# Altium schematic sheet 03. ZIGBEE.SchDoc
size A3; DocumentNumber: 3; SheetNumber: 3; SheetTotal: 12
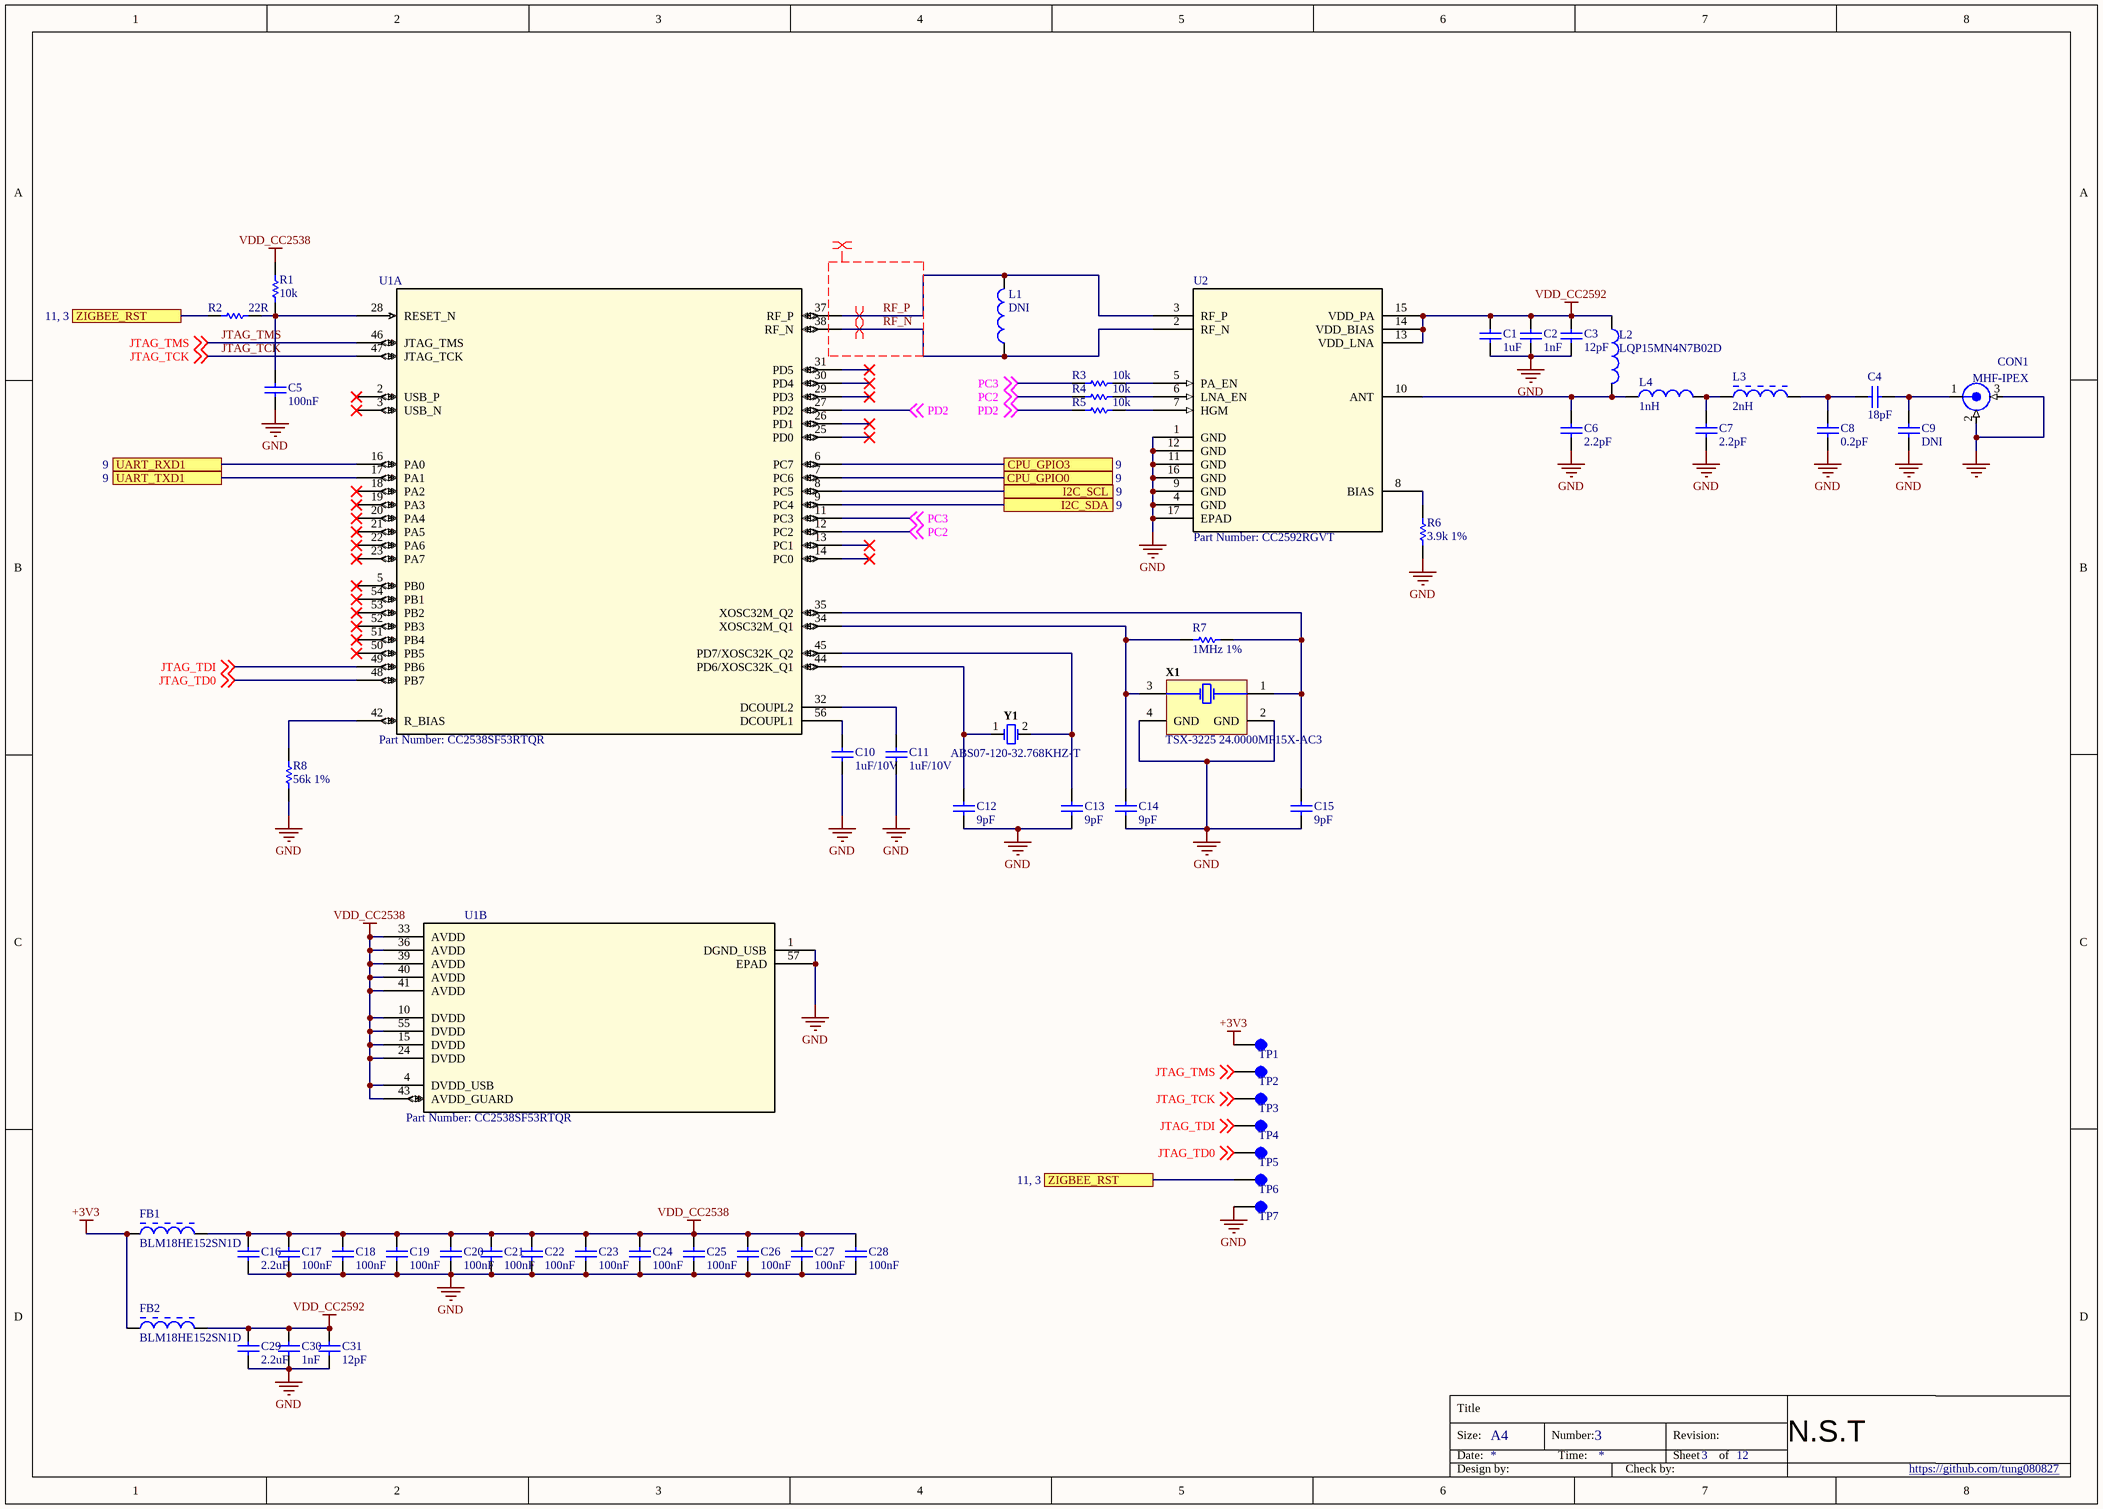
[diagram p0: 03. ZIGBEE.SchDoc]

## Parts
C1  1uF  [CAPC1608X90X20NL10]
C2  1nF  [CAPC1005X55X25NL05T10]
C3  12pF  [CAPC1005X55X25NL05T10]
C4  18pF  [CAPC1005X55X25NL05T10]
C5  100nF  [CAPC1005X56X25NL10T15]
C6  2.2pF  [CAPC1005X55X25NL05T10]
C7  2.2pF  [CAPC1005X55X25NL05T10]
C8  0.2pF  [CAPC1005X55X25NL05T10]
C9  DNI  [CAPC1005X55X25NL05T10]
C10  1uF/10V  [CAPC1005X55X25NL05T10]
C11  1uF/10V  [CAPC1005X55X25NL05T10]
C12  9pF  [CAPC1005X55X25NL05T10]
C13  9pF  [CAPC1005X55X25NL05T10]
C14  9pF  [CAPC1005X55X25NL05T10]
C15  9pF  [CAPC1005X55X25NL05T10]
C16  2.2uF  [CAPC1608X90X35NL10T15]
C17  100nF  [CAPC1005X56X25NL10T15]
C18  100nF  [CAPC1005X56X25NL10T15]
C19  100nF  [CAPC1005X56X25NL10T15]
C20  100nF  [CAPC1005X56X25NL10T15]
C21  100nF  [CAPC1005X56X25NL10T15]
C22  100nF  [CAPC1005X56X25NL10T15]
C23  100nF  [CAPC1005X56X25NL10T15]
C24  100nF  [CAPC1005X56X25NL10T15]
C25  100nF  [CAPC1005X56X25NL10T15]
C26  100nF  [CAPC1005X56X25NL10T15]
C27  100nF  [CAPC1005X56X25NL10T15]
C28  100nF  [CAPC1005X56X25NL10T15]
C29  2.2uF  [CAPC1608X90X35NL10T15]
C30  1nF  [CAPC1005X55X25NL05T10]
C31  12pF  [CAPC1005X55X25NL05T10]
CON1  MHF-IPEX  [I-PEX CON]
FB1  BLM18HE152SN1D  [MURA-BLM18-RF-H4-CHIP-2_V]
FB2  BLM18HE152SN1D  [MURA-BLM18-RF-H4-CHIP-2_V]
L1  DNI  [INDC1005X45X25NL10T10]
L2  LQP15MN4N7B02D  [INDC1005X45X25LL10T10]
L3  2nH  [MURA-IND0402_V]
L4  1nH  [INDC1005X45X25NL10T10]
R1  10k  [RESC1005X40X25NL05T05]
R2  22R  [RESC1005X40X25LL05T05]
R3  10k  [RESC1005X40X25NL05T05]
R4  10k  [RESC1005X40X25NL05T05]
R5  10k  [RESC1005X40X25NL05T05]
R6  3.9k 1%  [RESC1005X40X25NL05T05]
R7  1MHz 1%  [RESC1005X40X25NL05T05]
R8  56k 1%  [RESC1005X40X25NL05T05]
TP1  Test Point  [TP]  (value not drawn)
TP2  Test Point  [TP]  (value not drawn)
TP3  Test Point  [TP]  (value not drawn)
TP4  Test Point  [TP]  (value not drawn)
TP5  Test Point  [TP]  (value not drawn)
TP6  Test Point  [TP]  (value not drawn)
TP7  Test Point  [TP]  (value not drawn)
U1  Part Number: CC2538SF53RTQR  [QFN56_6P7X6P7]  (parts A,B of 2)
U2  Part Number: CC2592RGVT  [QFN16_2P16X2P16]
X1  TSX-3225 24.0000MF15X-AC3  [FP-NX3225SA-MFG]
Y1  ABS07-120-32.768KHZ-T  [ABRA-ABS07_A_V]

## Ports
CPU_GPIO0 (see 9), CPU_GPIO3 (see 9), I2C_SCL (see 9), I2C_SDA (see 9), UART_RXD1 (see 9), UART_TXD1 (see 9), ZIGBEE_RST (see 11, 3)

## Nets
+3V3: FB1.1 FB2.1 TP1.1
GND: C1.1 C2.1 C3.1 C5.1 C6.1 C7.1 C8.1 C9.1 C10.1 C11.1 C12.1 C13.1 C14.1 C15.1 C16.1 C17.1 C18.1 C19.1 C20.1 C21.1 C22.1 C23.1 C24.1 C25.1 C26.1 C27.1 C28.1 C29.1 C30.1 C31.1 CON1.2 CON1.3(GNDA) R6.1 R8.1 TP7.1 U1.1(DGND_USB) U1.57(EPAD) U2.1(GND) U2.4(GND) U2.9(GND) U2.11(GND) U2.12(GND) U2.16(GND) U2.17(EPAD) X1.2(GND) X1.4(GND)
VDD_CC2538: C16.2 C17.2 C18.2 C19.2 C20.2 C21.2 C22.2 C23.2 C24.2 C25.2 C26.2 C27.2 C28.2 FB1.2 R1.2 U1.4(DVDD_USB) U1.10(DVDD) U1.15(DVDD) U1.24(DVDD) U1.33(AVDD) U1.36(AVDD) U1.39(AVDD) U1.40(AVDD) U1.41(AVDD) U1.43(AVDD_GUARD) U1.55(DVDD)
VDD_CC2592: C1.2 C2.2 C3.2 C29.2 C30.2 C31.2 FB2.2 L2.1 U2.13(VDD_LNA) U2.14(VDD_BIAS) U2.15(VDD_PA)
CPU_GPIO0: U1.7(PC6) ; port CPU_GPIO0
CPU_GPIO3: U1.6(PC7) ; port CPU_GPIO3
I2C_SCL: U1.8(PC5) ; port I2C_SCL
I2C_SDA: U1.9(PC4) ; port I2C_SDA
JTAG_TCK: TP3.1 U1.47(JTAG_TCK) ; off-sheet JTAG_TCK
JTAG_TD0: TP5.1 U1.48(PB7) ; off-sheet JTAG_TD0
JTAG_TDI: TP4.1 U1.49(PB6) ; off-sheet JTAG_TDI
JTAG_TMS: TP2.1 U1.46(JTAG_TMS) ; off-sheet JTAG_TMS
PC2: R4.1 U1.12(PC2) ; off-sheet PC2
PC3: R3.1 U1.11(PC3) ; off-sheet PC3
PD2: R5.1 U1.27(PD2) ; off-sheet PD2
RF_N: L1.1 U1.38(RF_N) U2.2(RF_N)
RF_P: L1.2 U1.37(RF_P) U2.3(RF_P)
UART_RXD1: U1.16(PA0) ; port UART_RXD1
UART_TXD1: U1.17(PA1) ; port UART_TXD1
ZIGBEE_RST: R2.1 TP6.1 ; port ZIGBEE_RST
NetC4_1: C4.1 C8.2 L3.2
NetC4_2: C4.2 C9.2 CON1.1
NetC5_2: C5.2 R1.1 R2.2 U1.28(RESET_N)
NetC6_2: C6.2 L2.2 L4.1 U2.10(ANT)
NetC7_2: C7.2 L3.1 L4.2
NetC10_2: C10.2 U1.56(DCOUPL1)
NetC11_2: C11.2 U1.32(DCOUPL2)
NetC12_2: C12.2 U1.44(PD6/XOSC32K_Q1) Y1.1
NetC13_2: C13.2 U1.45(PD7/XOSC32K_Q2) Y1.2
NetC14_2: C14.2 R7.1 U1.34(XOSC32M_Q1) X1.3(X2)
NetC15_2: C15.2 R7.2 U1.35(XOSC32M_Q2) X1.1(X1)
NetR3_2: R3.2 U2.5(PA_EN)
NetR4_2: R4.2 U2.6(LNA_EN)
NetR5_2: R5.2 U2.7(HGM)
NetR6_2: R6.2 U2.8(BIAS)
NetR8_2: R8.2 U1.42(R_BIAS)

Not connected (* = marked no-connect by the designer): U1 2(USB_P)* 3(USB_N)* 5(PB0)* 13(PC1)* 14(PC0)* 18(PA2)* 19(PA3)* 20(PA4)* 21(PA5)* 22(PA6)* 23(PA7)* 25(PD0)* 26(PD1)* 29(PD3)* 30(PD4)* 31(PD5)* 50(PB5)* 51(PB4)* 52(PB3)* 53(PB2)* 54(PB1)*

## Layout directives
differential pair: RF_N, RF_P
net class ZIGBEE_RF; rule Matched Net Lengths [Tolerance = 10mil]: RF_N, RF_P

## Notes on the sheet
- Title
- Size:
- Date:
- A4
- Number:
- Time:
- Revision:
- Sheet
- of
- N.S.T
- Design by:
- Check by:
- https://github.com/tung080827

## Library data of the parts
C1 = CMP-2000-06025-1: Chip Capacitor, 1 uF, +/- 10%, 50 V, -55 to 85 degC, 0603 (1608 Metric), RoHS, Tape and Reel; Manufacturer: TDK; PCN Part Number: MLCCPartNumberChange30/Nov/2012; Other Names: 445-7468-6; Online Catalog: CSeries,GeneralPurpose; Capacitance: 1µF; Product Training Modules: CSeriesGeneralApplicationsSEAT,CCV,andTVCLDesignToolsGuidetoReplacinganElectrolyticCapacitorwithanMLCC; Voltage - Rated: 50V; Design Resources: 20WNon-IsolatedBuckLEDDriverUsingPLLNK460KG; Temperature Coefficient: X5R; Series: C; Datasheet Version: 08/2016; Package Description: 2-Pin Surface Mount Device, Body 1.6 x 0.8 mm; Mounting Technology: SurfaceMount; Features: -; Size / Dimension: 0.063"Lx0.031"W(1.60mmx0.80mm); Lead Spacing: -; Operating Temperature: -55°C~85°C; Tolerance: ±10%; Height - Seated (Max): -; Mounting Type: SurfaceMount,MLCC; Ratings: -; Standard Package: 1; Applications: GeneralPurpose; Datasheet URL: https://product.tdk.com/info/en/catalog/datasheets/mlcc_commercial_general_en.pdf; Category: Capacitors; Lead Style: -; Packaging: Digi-Reel®; RoHS Information: RoHSCertificate-MLCC; Package / Case: 0603(1608Metric); Package Reference: 0603; Manufacturer URL: http://www.tdk.com/; Thickness (Max): 0.035"(0.90mm); Family: CeramicCapacitors
C2 C30 = CMP-2008-04254-1: Part Number: GRM1555C1H102JA01D; Manufacturer: Murata
C3 C31 = CMP-2008-03945-1: Part Number: GRM1555C1H120GA01D; Manufacturer: Murata
C4 C9 = CMP-2008-03748-1: Part Number: GJM1555C1H180GB01D; Manufacturer: Murata
C5 C17-C28 = CMP-2008-02743-1: Manufacturer: AVX Interconnect / Elco; Part Number: 04026D104KAT2A
C6 C7 = CMP-2008-03835-1: Part Number: GJM1555C1H2R2BB01D; Manufacturer: Murata
C8 = CMP-2008-03980-1: Part Number: GRM1555C1HR20WA01D; Manufacturer: Murata
C10 C11 = CMP-2008-04556-1: Part Number: GRM155R61A105KE15D; Manufacturer: Murata
C12-C15 = CMP-2008-03890-1: Part Number: GJM1555C1H9R0CB01D; Manufacturer: Murata
C16 C29 = CMP-2006-02354-1: Manufacturer: Murata; Part Number: GCM188R70J225KE22D
CON1 = SMA/UFLR
FB1 FB2 = CMP-0686-00368-2: Chip Ferrite Bead for GHz Band High-speed Signal Lines, 1500 Ohm, 500 mA, -55 to 125 degC, 1.6 x 0.8 x 0.95 mm SMD, Tape and Reel; Manufacturer: Murata; Rated Current: 500 mA; Impedance (at 100 MHz): 1500 Ohm +/- 25%; DC Resistance: 0.50 Ohm Max.; Packing: Tape and Reel; DatasheetVersion: 08/2013; ComponentLink1URL: http://www.murata.com/; Mounting Technology: Surface Mount; ComponentLink2URL: http://www.murata.com/products/catalog/pdf/c31e.pdf; ComponentLink3Description: Package Specification; ComponentLink2Description: Datasheet; PackageReference: BLM18_H950-2; ComponentLink1Description: Manufacturer URL; PackageDescription: 2-Pin Chip, Body 1.6 x 0.8 mm; ComponentLink3URL: http://www.murata.com/products/catalog/pdf/c31e.pdf; PartNumber: BLM18HE152SN1D; Operating Temperature Range: -55 to 125 degC
L1 = CMP-2000-06590-1: Chip Inductor, 1.8 nH, +/- 0.1 nH, 280 mA, -40 to 85 degC, 0402 (1005 Metric), RoHS, Tape and Reel; Manufacturer: Murata; DC Resistance: 0.2O; Tolerance (nH): ±0.1nH; Rated Current-Max: 280mA; Inductance-Nom: 1.8nH; Manufacturer URL: http://www.murata.com/; Mounting Technology: SurfaceMount; Datasheet URL: http://search.murata.co.jp/Ceramy/image/img/PDF/ENG/L0075S0084LQP15M.pdf; Datasheet Version: 09/2010; Package Reference: 0402; Case Size/Dimension: 0402; Package Description: 2-Pin Surface Mount Device, Body 1 x 0.5 mm
L2 = CMP-2000-06592-1: Chip Inductor, 4.7 nH, +/- 0.1 nH, 160 mA, -40 to 85 degC, 0402 (1005 Metric), RoHS, Tape and Reel; Manufacturer: Murata; Maximum DC Resistance: 600mOhm; Type: RFChip; Inductance: 4.7nH; Product Height: 0.45mm; Maximum DC Current: 160mA; Minimum Quality Factor: 13@500MHz; Rad Hard: No; Tolerance: 0.1nH; Product Depth: 0.6mm; Package Description: 2-Pin Surface Mount Device, Body 1 x 0.5 mm; Package Reference: 0402; Datasheet Version: 09/2010; Packaging: Tape&Reel; Manufacturer URL: http://www.murata.com/; Package/Case: 0402; Datasheet URL: http://search.murata.co.jp/Ceramy/image/img/PDF/ENG/L0075S0084LQP15M.pdf; Mounting Technology: SurfaceMount
L3 = CMP-0499-00001-3: Chip Inductor (Chip Coil) for High Frequency Multilayer, 2 +/- 0.3 nH, 300 mA, 0402 (1005), 180mm Paper Tape; Manufacturer: Murata; PartNumber: LQG15HS2N0S02D; Self Resonance Frequency (min.): 6000 MHz; Inductance Test Frequency: 100 MHz; Inductance: 2.0 nH +/- 0.3 nH; Rated Current (Itemp) (Based on Temperature rise): 300 mA; Max. Of DC Resistance: 0.1 ohm; Q (min.): 8; Operating Temperature Range: -55 to 125 degC; Mounting Technology: Surface Mount; PackageDescription: 2-Pin SMT Inductor, 1 x 0.5 mm Body; ComponentLink2URL: http://search.murata.co.jp/Ceramy/image/img/PDF/ENG/L0075S0083LQG15HS.pdf; ComponentLink1Description: Manufacturer URL; ComponentLink3URL: http://search.murata.co.jp/Ceramy/image/img/PDF/ENG/L0075S0083LQG15HS.pdf; ComponentLink1URL: http://www.murata.com/; ComponentLink2Description: Datasheet; RoHS: Yes; ComponentLink3Description: Package Specification; Q Test Frequency: 100 MHz; PackageReference: IND0402
L4 = CMP-1662-00009-1: Chip Inductor, 1 nH, +/- 0.1 nH, 400 mA, -40 to 85 degC, 0402 (1005 Metric), RoHS, Tape and Reel; PartNumber: LQP15MN1N0B02D; Height: 0.35 mm; Mounting Technology: Surface Mount; Radiation Hardening: No; Max Operating Temperature: 85 degC; Package Quantity: 10000; ComponentLink2Description: Datasheet; ComponentLink2URL: https://www.modelithics.com/models/Vendor/MuRata/LQP15M.pdf; RoHSCompliant: True; ComponentLink1Description: Manufacturer URL; Mount: Surface Mount; Width: 0.5 mm; Min Operating Temperature: -40 degC; Length: 1 mm; ComponentLink1URL: http://www.murata.com/; DatasheetVersion: 09/2010; PackageDescription: 2-Pin Surface Mount Device, Body 1 x 0.5 mm; Case/Package: 0402; Packaging: Tape and Reel
R1 R3-R5 = CMP-2002-08135-1: Manufacturer: Vishay Dale; Part Number: CRCW040210K0FKED
R2 = CMP-1665-00027-3: Chip Resistor, 22 Ohm, +/- 1%, 0.1 W, -55 to 155 degC, 0402 (1005 Metric), RoHS, Tape and Reel; PartNumber: ERJ-2RKF22R0X; Case\/Package: 0402; Resistance: 22 Ohm; Power Rating: 100 mW; Voltage Rating: 50 V; ComponentLink2Description: Datasheet; Packaging: Tape and Reel; Weight: 2.8E-05oz; Pins: 2; Case Code (Imperial): 0402; Width: 0.5 mm; ComponentLink2URL: http://industrial.panasonic.com/cdbs/www-data/pdf/RDA0000/AOA0000C86.pdf; Height: 0.35 mm; PackageReference: 0402; REACH SVHC: Yes; Min Operating Temperature: -55 degC; Length: 1 mm; DatasheetVersion: 04/2015; RoHSCompliant: true; Package Quantity: 10000; Case Code (Metric): 1005; PackageDescription: 2-Pin Surface Mount Device, Body 1 x 0.5 mm; ComponentLink1URL: http://www.panasonic.com/; Mount: Surface Mount; Mounting Technology: Surface Mount; Tolerance: 1%; Max Operating Temperature: 155 degC; ComponentLink1Description: Manufacturer URL
R6 = CMP-2002-08592-1: Manufacturer: Vishay Dale; Part Number: CRCW04023K90FKED
R7 = CMP-2002-08122-1: Part Number: CRCW04020000Z0ED; Manufacturer: Vishay Dale
R8 = CMP-2002-00101-1: Part Number: CRCW040256K0FKED; Manufacturer: Vishay Dale
TP1-TP7 = TP
U1 = CC2538SF53RTQR: IC RF TxRx + MCU 802.15.4 6LoWPAN, Zigbee® 2.4GHz 56-VFQFN Exposed Pad; Vendor: Texas Instruments; Built_By: EMA_UL_Team; Manufacturer_Part_Number: CC2538SF53RTQR; Copyright: Copyright (C) 2018 Accelerated Designs. All rights reserved; RefDes: RefDes; Type: DEV; Value: Value
U2 = CC2592RGVT: No Description Available; Vendor: Texas Instruments; Built_By: EMA_UL_Team; Manufacturer_Part_Number: CC2592RGVT; Copyright: Copyright (C) 2018 Accelerated Designs. All rights reserved; RefDes: RefDes; Type: DEV; Value: Value
X1 = CMP-2000-07333-1: MHz Range Crystal, 24 MHz, -40 to 85 degC, 4-Pin SMD, RoHS, Tape and Reel; Manufacturer: Epson; Brand: EpsonTiming; Frequency Stability: 10PPM; Frequency: 24MHz; ESR: 40Ohms; Load Capacitance: 9pF; Unit Weight: 0.000564oz; Drive Level: 200uW; Datasheet Version: 12/2015; RoHS: True; Operating Temperature Range: -40Cto+85C; Length: 3.2mm; Tolerance: 10PPM; Width: 2.5mm; Mounting Technology: SurfaceMount; Package Description: 4-Pin Surface Mount Device, Body 3.2 x 2.5 mm; Manufacturer URL: https://www.eea.epson.com/; Factory Pack Quantity: 250; Package Reference: TSX-3225; Height: 0.6mm; Mounting Style: SMD/SMT; Termination Style: SMD/SMT; Datasheet URL: https://support.epson.biz/td/api/doc_check.php?dl=brief_FA-238V_en.pdf; Type: Crystal; Series: TSX-3225; Package / Case: 3.2mmx2.5mm; Product Category: Crystals; Packaging: Reel
Y1 = CMP-2000-07587-1: Tuning Fork Crystal, 32.768 KHz, +/- 20 ppm, -40 to 85 degC, 2-Pin SMD, RoHS, Tape and Reel; Manufacturer: Abracon; Case\/Package: SMD/SMT; Series Resistance: 60KOhm; Frequency Tolerance: 20ppm; Load Capacitance: 6pF; ESR (Equivalent Series Resistance): 55KOhm; Max Operating Temperature: 85degC; Width: 0.061inch; Radiation Hardening: No; Lead Free: LeadFree; RoHSCompliant: True; Depth: 1.5mm; Datasheet URL: http://www.abracon.com/Resonators/ABS07-120-32.768kHz-T.pdf; Frequency: 32.768KHz; Termination: SMD/SMT; Manufacturer URL: http://www.abracon.com/; Package Quantity: 3000; Packaging: TapeandReel; Number of Pins: 2; Height: 0.035inch; Package Description: 2-Pin Surface Mount Device, Body 3.2 x 1.5 mm; Package Reference: ABS07; Mount: SurfaceMount; Tolerance: 20ppm; Mounting Technology: SurfaceMount; REACH SVHC: NoSVHC; Datasheet Version: 11/2014; Length: 3.2mm; Min Operating Temperature: -40degC